# Altium schematic sheet Power_Board_Schematics_Master.SchDoc
size A4
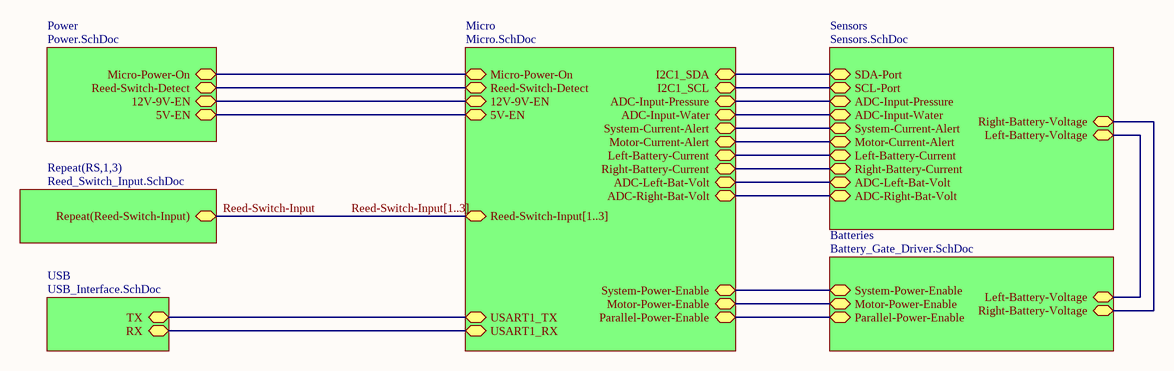
[diagram p0: Power_Board_Schematics_Master.SchDoc]

## Sub-sheets
Batteries = Battery_Gate_Driver.SchDoc: Motor-Power-Enable, System-Power-Enable, Parallel-Power-Enable, Left-Battery-Voltage, Right-Battery-Voltage
Micro = Micro.SchDoc: Micro-Power-On, Reed-Switch-Detect, Reed-Switch-Input[1..3], Motor-Power-Enable, System-Power-Enable, USART1_RX, USART1_TX, I2C1_SDA, I2C1_SCL, ADC-Input-Pressure, ADC-Input-Water, System-Current-Alert, Motor-Current-Alert, Left-Battery-Current, Right-Battery-Current, 12V-9V-EN, 5V-EN, Parallel-Power-Enable, ADC-Left-Bat-Volt, ADC-Right-Bat-Volt
Power = Power.SchDoc: Micro-Power-On, Reed-Switch-Detect, 12V-9V-EN, 5V-EN
Repeat(RS,1,3) = Reed_Switch_Input.SchDoc: Repeat(Reed-Switch-Input)
Sensors = Sensors.SchDoc: SDA-Port, SCL-Port, ADC-Input-Pressure, ADC-Input-Water, System-Current-Alert, Motor-Current-Alert, Left-Battery-Current, Right-Battery-Current, Left-Battery-Voltage, Right-Battery-Voltage, ADC-Left-Bat-Volt, ADC-Right-Bat-Volt
USB = USB_Interface.SchDoc: TX, RX

## Nets
Reed-Switch-Input: sheet Repeat(RS,1,3)/Repeat(Reed-Switch-Input)
(unnamed): sheet Micro/Micro-Power-On, sheet Power/Micro-Power-On
(unnamed): sheet Micro/Reed-Switch-Detect, sheet Power/Reed-Switch-Detect
(unnamed): sheet Micro/Motor-Power-Enable, sheet Batteries/Motor-Power-Enable
(unnamed): sheet Micro/System-Power-Enable, sheet Batteries/System-Power-Enable
(unnamed): sheet Micro/USART1_RX, sheet USB/RX
(unnamed): sheet Micro/USART1_TX, sheet USB/TX
(unnamed): sheet Micro/I2C1_SDA, sheet Sensors/SDA-Port
(unnamed): sheet Micro/I2C1_SCL, sheet Sensors/SCL-Port
(unnamed): sheet Micro/ADC-Input-Pressure, sheet Sensors/ADC-Input-Pressure
(unnamed): sheet Micro/ADC-Input-Water, sheet Sensors/ADC-Input-Water
(unnamed): sheet Micro/System-Current-Alert, sheet Sensors/System-Current-Alert
(unnamed): sheet Micro/Motor-Current-Alert, sheet Sensors/Motor-Current-Alert
(unnamed): sheet Micro/Left-Battery-Current, sheet Sensors/Left-Battery-Current
(unnamed): sheet Micro/Right-Battery-Current, sheet Sensors/Right-Battery-Current
(unnamed): sheet Micro/12V-9V-EN, sheet Power/12V-9V-EN
(unnamed): sheet Micro/5V-EN, sheet Power/5V-EN
(unnamed): sheet Micro/Parallel-Power-Enable, sheet Batteries/Parallel-Power-Enable
(unnamed): sheet Micro/ADC-Left-Bat-Volt, sheet Sensors/ADC-Left-Bat-Volt
(unnamed): sheet Micro/ADC-Right-Bat-Volt, sheet Sensors/ADC-Right-Bat-Volt
(unnamed): sheet Batteries/Left-Battery-Voltage, sheet Sensors/Left-Battery-Voltage
(unnamed): sheet Batteries/Right-Battery-Voltage, sheet Sensors/Right-Battery-Voltage

## Buses and harness runs
bus Reed-Switch-Input[1..3] = sheet Micro/Reed-Switch-Input[1..3]